# Altium schematic sheet 19_2_Coupled_PP0_Top.SchDoc
size 863 x 558 mm; DocumentNumber: 1; SheetNumber: 1; SheetTotal: 2; PageSetup: Record=PageOptions|CenterHorizontal=True|CenterVertical=True|PrintScale=0.48|XCorrection=1.00|YCorrection=1.00|PrintKind=0|BorderSize=5000000|LeftOffset=0|BottomOffset=0|Orientation=2|PaperLength=1000|PaperWidth=1000|Scale=100|PaperSource=15|PrintQuality=-3|MediaType=1|DitherType=10|PrintScaleMode=1|PaperKind=11x17|PaperIndex=17
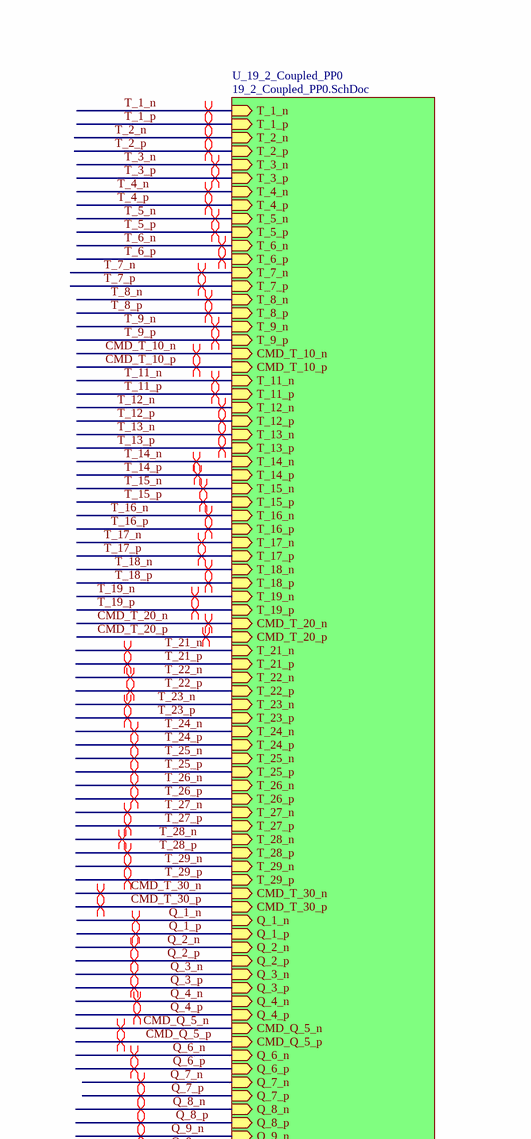
[diagram p0: 19_2_Coupled_PP0_Top.SchDoc, top left]
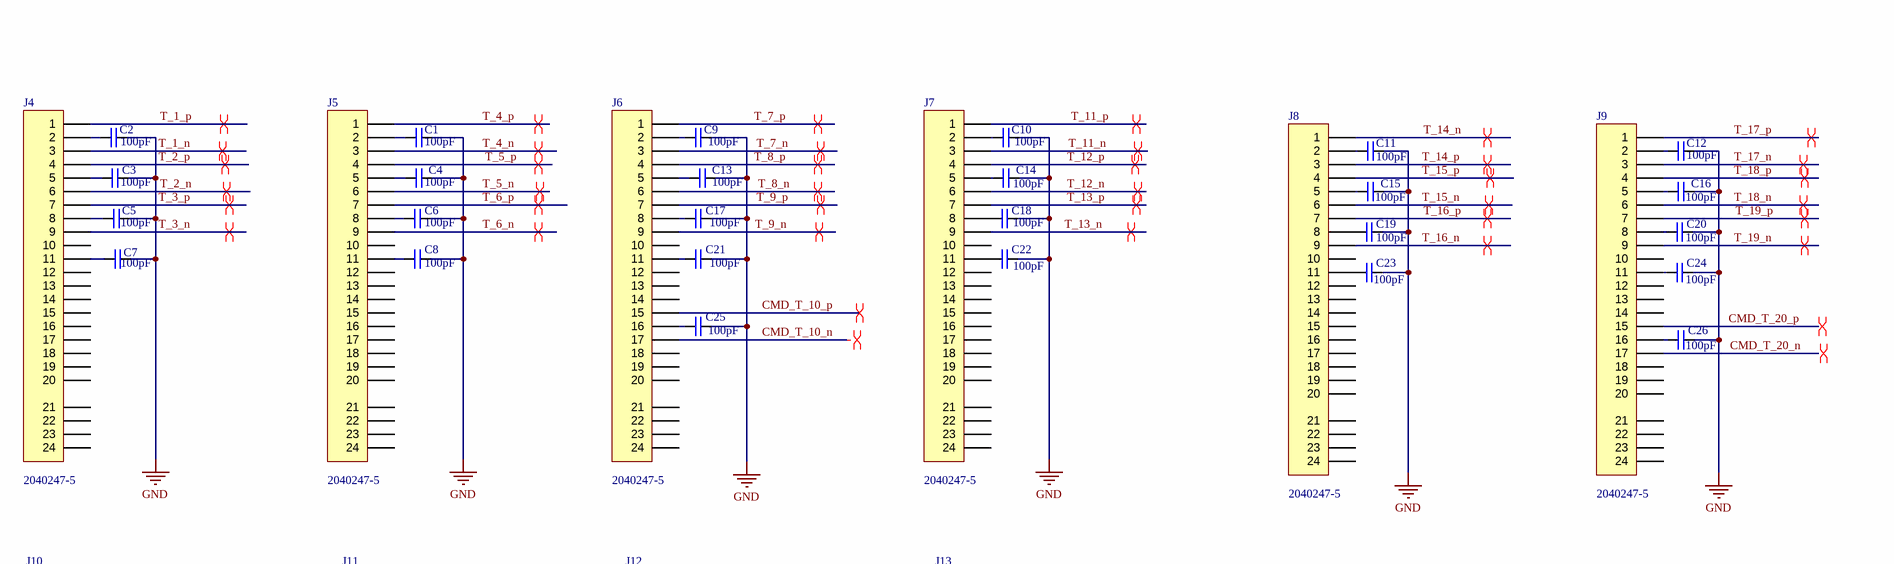
[diagram p1: 19_2_Coupled_PP0_Top.SchDoc, top right]
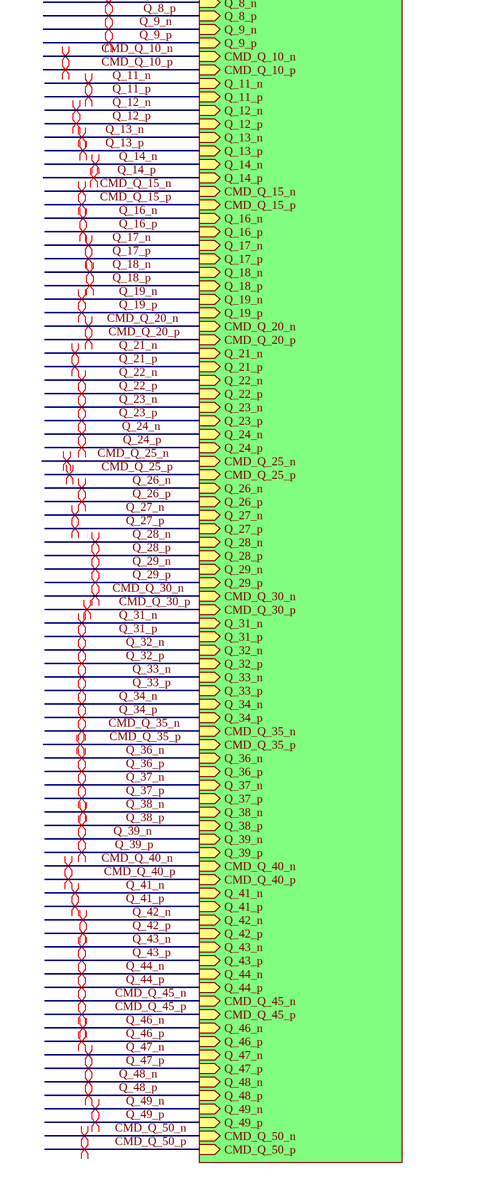
[diagram p2: 19_2_Coupled_PP0_Top.SchDoc, bottom left]
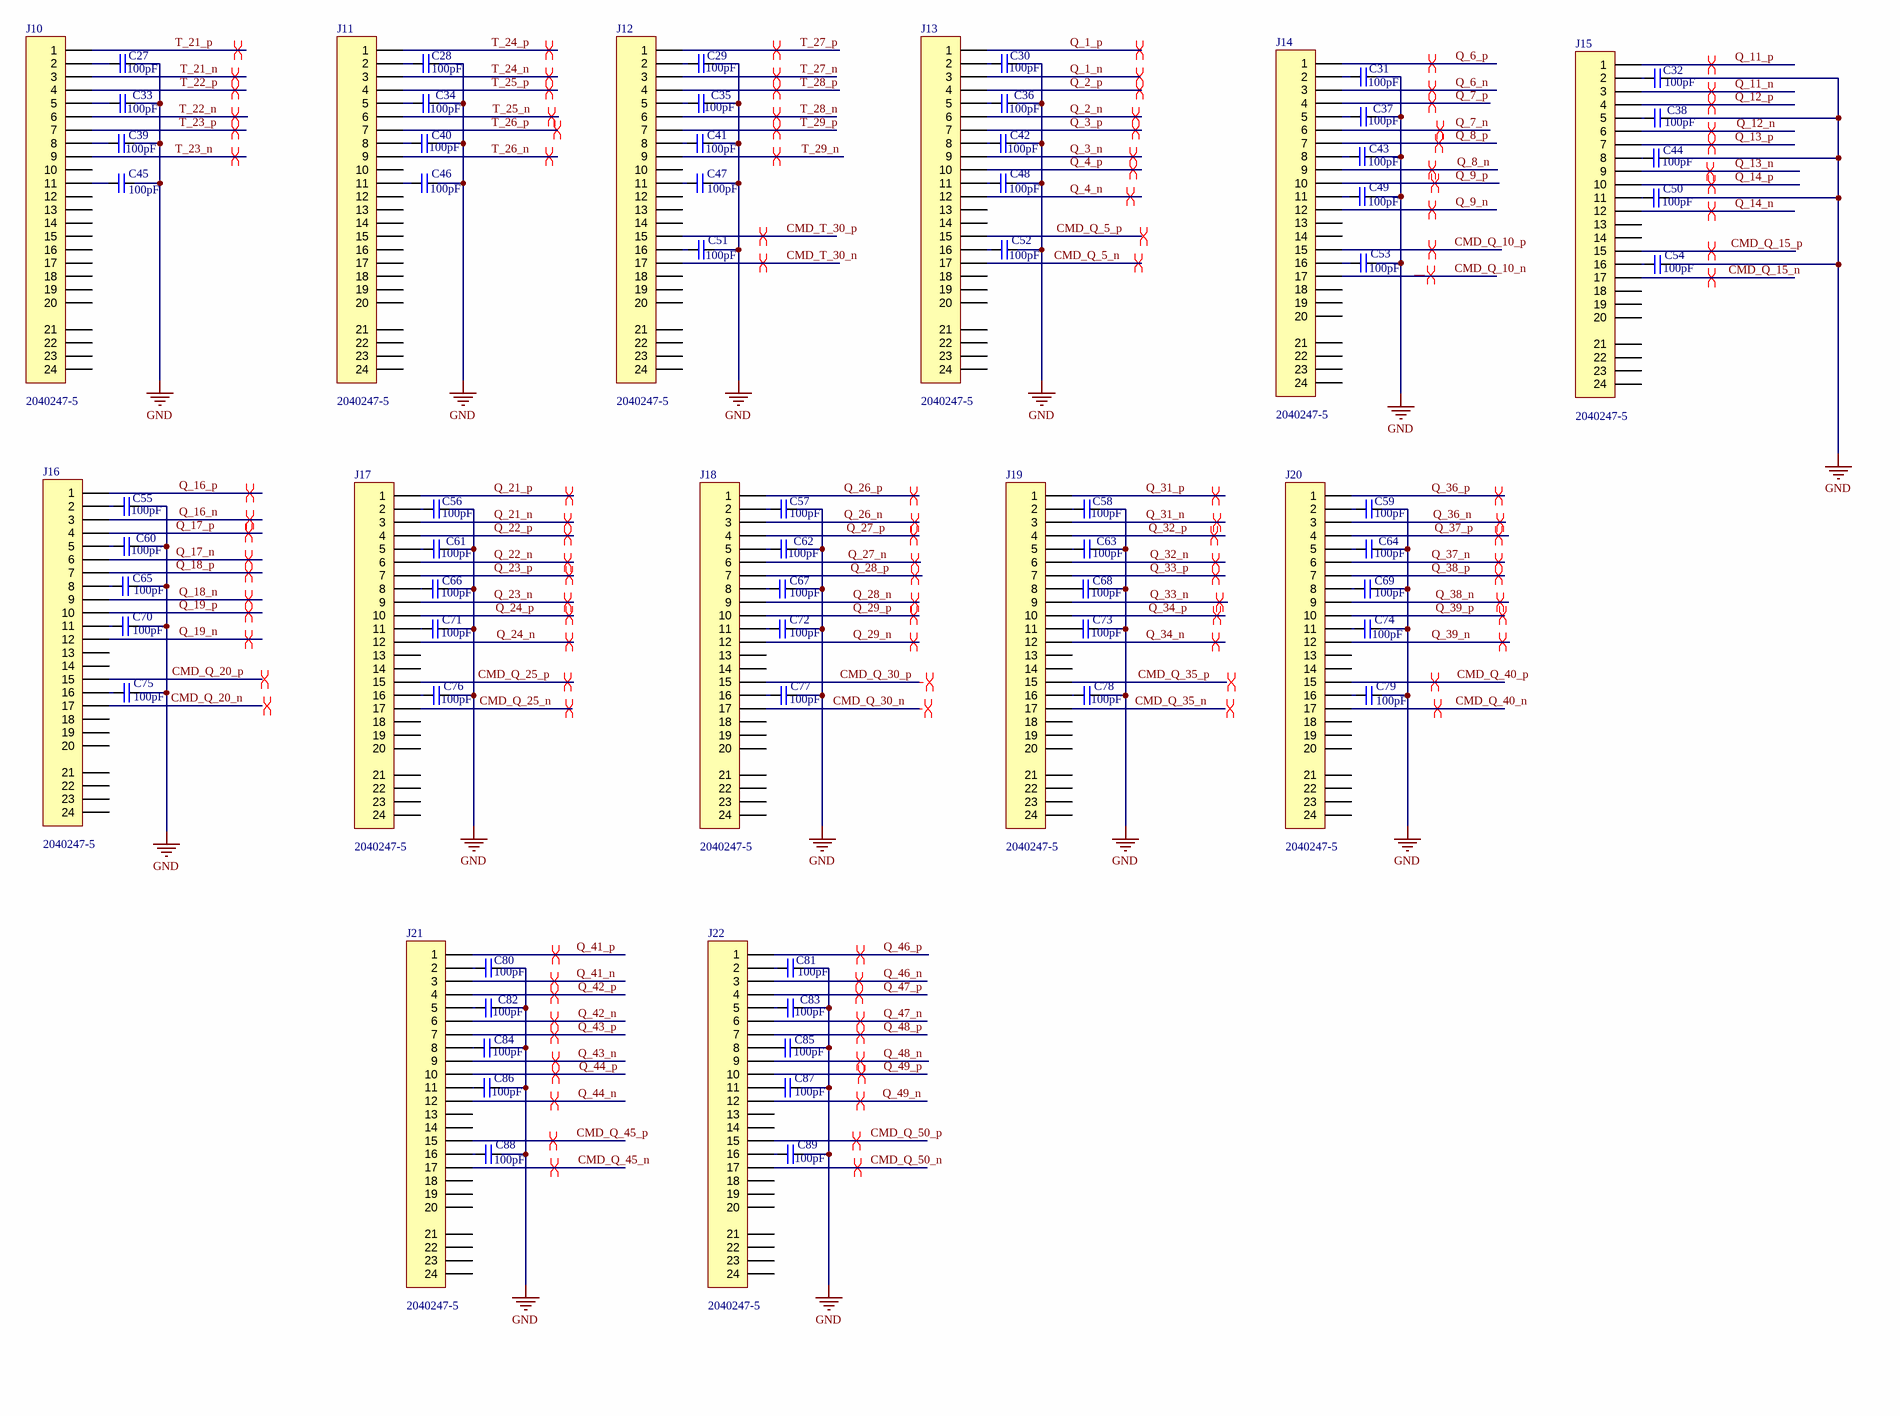
[diagram p3: 19_2_Coupled_PP0_Top.SchDoc, bottom right]

## Parts
C1  100pF  [SM0201]
C2  100pF  [SM0201]
C3  100pF  [SM0201]
C4  100pF  [SM0201]
C5  100pF  [SM0201]
C6  100pF  [SM0201]
C7  100pF  [SM0201]
C8  100pF  [SM0201]
C9  100pF  [SM0201]
C10  100pF  [SM0201]
C11  100pF  [SM0201]
C12  100pF  [SM0201]
C13  100pF  [SM0201]
C14  100pF  [SM0201]
C15  100pF  [SM0201]
C16  100pF  [SM0201]
C17  100pF  [SM0201]
C18  100pF  [SM0201]
C19  100pF  [SM0201]
C20  100pF  [SM0201]
C21  100pF  [SM0201]
C22  100pF  [SM0201]
C23  100pF  [SM0201]
C24  100pF  [SM0201]
C25  100pF  [SM0201]
C26  100pF  [SM0201]
C27  100pF  [SM0201]
C28  100pF  [SM0201]
C29  100pF  [SM0201]
C30  100pF  [SM0201]
C31  100pF  [SM0201]
C32  100pF  [SM0201]
C33  100pF  [SM0201]
C34  100pF  [SM0201]
C35  100pF  [SM0201]
C36  100pF  [SM0201]
C37  100pF  [SM0201]
C38  100pF  [SM0201]
C39  100pF  [SM0201]
C40  100pF  [SM0201]
C41  100pF  [SM0201]
C42  100pF  [SM0201]
C43  100pF  [SM0201]
C44  100pF  [SM0201]
C45  100pF  [SM0201]
C46  100pF  [SM0201]
C47  100pF  [SM0201]
C48  100pF  [SM0201]
C49  100pF  [SM0201]
C50  100pF  [SM0201]
C51  100pF  [SM0201]
C52  100pF  [SM0201]
C53  100pF  [SM0201]
C54  100pF  [SM0201]
C55  100pF  [SM0201]
C56  100pF  [SM0201]
C57  100pF  [SM0201]
C58  100pF  [SM0201]
C59  100pF  [SM0201]
C60  100pF  [SM0201]
C61  100pF  [SM0201]
C62  100pF  [SM0201]
C63  100pF  [SM0201]
C64  100pF  [SM0201]
C65  100pF  [SM0201]
C66  100pF  [SM0201]
C67  100pF  [SM0201]
C68  100pF  [SM0201]
C69  100pF  [SM0201]
C70  100pF  [SM0201]
C71  100pF  [SM0201]
C72  100pF  [SM0201]
C73  100pF  [SM0201]
C74  100pF  [SM0201]
C75  100pF  [SM0201]
C76  100pF  [SM0201]
C77  100pF  [SM0201]
C78  100pF  [SM0201]
C79  100pF  [SM0201]
C80  100pF  [SM0201]
C81  100pF  [SM0201]
C82  100pF  [SM0201]
C83  100pF  [SM0201]
C84  100pF  [SM0201]
C85  100pF  [SM0201]
C86  100pF  [SM0201]
C87  100pF  [SM0201]
C88  100pF  [SM0201]
C89  100pF  [SM0201]
J4  2040247-5  [Tyco_2040247-5]
J5  2040247-5  [Tyco_2040247-5]
J6  2040247-5  [Tyco_2040247-5]
J7  2040247-5  [Tyco_2040247-5]
J8  2040247-5  [Tyco_2040247-5]
J9  2040247-5  [Tyco_2040247-5]
J10  2040247-5  [Tyco_2040247-5]
J11  2040247-5  [Tyco_2040247-5]
J12  2040247-5  [Tyco_2040247-5]
J13  2040247-5  [Tyco_2040247-5]
J14  2040247-5  [Tyco_2040247-5]
J15  2040247-5  [Tyco_2040247-5]
J16  2040247-5  [Tyco_2040247-5]
J17  2040247-5  [Tyco_2040247-5]
J18  2040247-5  [Tyco_2040247-5]
J19  2040247-5  [Tyco_2040247-5]
J20  2040247-5  [Tyco_2040247-5]
J21  2040247-5  [Tyco_2040247-5]
J22  2040247-5  [Tyco_2040247-5]

## Sub-sheets
U_19_2_Coupled_PP0 = 19_2_Coupled_PP0.SchDoc: T_1_n (in), T_1_p (in), T_2_n (in), T_2_p (in), T_3_n (in), T_3_p (in), T_4_n (in), T_4_p (in), T_5_n (in), T_5_p (in), T_6_n (in), T_6_p (in), T_7_n (in), T_7_p (in), T_8_n (in), T_8_p (in), T_9_n (in), T_9_p (in), CMD_T_10_n (in), CMD_T_10_p (in), T_11_n (in), T_11_p (in), T_12_n (in), T_12_p (in), T_13_n (in), T_13_p (in), T_14_n (in), T_14_p (in), T_15_n (in), T_15_p (in), T_16_n (in), T_16_p (in), T_17_n (in), T_17_p (in), T_18_n (in), T_18_p (in), T_19_n (in), T_19_p (in), CMD_T_20_n (in), CMD_T_20_p (in), T_21_n (in), T_21_p (in), T_22_n (in), T_22_p (in), T_23_n (in), T_23_p (in), T_24_n (in), T_24_p (in), T_25_n (in), T_25_p (in), T_26_n (in), T_26_p (in), T_27_n (in), T_27_p (in), T_28_n (in), T_28_p (in), T_29_n (in), T_29_p (in), CMD_T_30_n (in), CMD_T_30_p (in), Q_1_n (in), Q_1_p (in), Q_2_n (in), Q_2_p (in), Q_3_n (in), Q_3_p (in), Q_4_n (in), Q_4_p (in), CMD_Q_5_n (in), CMD_Q_5_p (in), Q_6_n (in), Q_6_p (in), Q_7_n (in), Q_7_p (in), Q_8_n (in), Q_8_p (in), Q_9_n (in), Q_9_p (in), CMD_Q_10_n (in), CMD_Q_10_p (in), Q_11_n (in), Q_11_p (in), Q_12_n (in), Q_12_p (in), Q_13_n (in), Q_13_p (in), Q_14_n (in), Q_14_p (in), CMD_Q_15_n (in), CMD_Q_15_p (in), Q_16_n (in), Q_16_p (in), Q_17_n (in), Q_17_p (in), Q_18_n (in), Q_18_p (in), Q_19_n (in), Q_19_p (in), CMD_Q_20_n (in), CMD_Q_20_p (in), Q_21_n (in), Q_21_p (in), Q_22_n (in), Q_22_p (in), Q_23_n (in), Q_23_p (in), Q_24_n (in), Q_24_p (in), CMD_Q_25_n (in), CMD_Q_25_p (in), Q_26_n (in), Q_26_p (in), Q_27_n (in), Q_27_p (in), Q_28_n (in), Q_28_p (in), Q_29_n (in), Q_29_p (in), CMD_Q_30_n (in), CMD_Q_30_p (in), Q_31_n (in), Q_31_p (in), Q_32_n (in), Q_32_p (in), Q_33_n (in), Q_33_p (in), Q_34_n (in), Q_34_p (in), CMD_Q_35_n (in), CMD_Q_35_p (in), Q_36_n (in), Q_36_p (in), Q_37_n (in), Q_37_p (in), Q_38_n (in), Q_38_p (in), Q_39_n (in), Q_39_p (in), CMD_Q_40_n (in), CMD_Q_40_p (in), Q_41_n (in), Q_41_p (in), Q_42_n (in), Q_42_p (in), Q_43_n (in), Q_43_p (in), Q_44_n (in), Q_44_p (in), CMD_Q_45_n (in), CMD_Q_45_p (in), Q_46_n (in), Q_46_p (in), Q_47_n (in), Q_47_p (in), Q_48_n (in), Q_48_p (in), Q_49_n (in), Q_49_p (in), CMD_Q_50_n (in), CMD_Q_50_p (in)

## Nets
GND: C1.1 C2.1 C3.1 C4.1 C5.1 C6.1 C7.1 C8.1 C9.1 C10.1 C11.1 C12.1 C13.1 C14.1 C15.1 C16.1 C17.1 C18.1 C19.1 C20.1 C21.1 C22.1 C23.1 C24.1 C25.1 C26.1 C27.1 C28.1 C29.1 C30.1 C31.1 C32.1 C33.1 C34.1 C35.1 C36.1 C37.1 C38.1 C39.1 C40.1 C41.1 C42.1 C43.1 C44.1 C45.1 C46.1 C47.1 C48.1 C49.1 C50.1 C51.1 C52.1 C53.1 C54.1 C55.1 C56.1 C57.1 C58.1 C59.1 C60.1 C61.1 C62.1 C63.1 C64.1 C65.1 C66.1 C67.1 C68.1 C69.1 C70.1 C71.1 C72.1 C73.1 C74.1 C75.1 C76.1 C77.1 C78.1 C79.1 C80.1 C81.1 C82.1 C83.1 C84.1 C85.1 C86.1 C87.1 C88.1 C89.1
CMD_Q_5_n: J13.17 ; sheet U_19_2_Coupled_PP0/CMD_Q_5_n
CMD_Q_5_p: J13.15 ; sheet U_19_2_Coupled_PP0/CMD_Q_5_p
CMD_Q_10_n: J14.17 ; sheet U_19_2_Coupled_PP0/CMD_Q_10_n
CMD_Q_10_p: J14.15 ; sheet U_19_2_Coupled_PP0/CMD_Q_10_p
CMD_Q_15_n: J15.17 ; sheet U_19_2_Coupled_PP0/CMD_Q_15_n
CMD_Q_15_p: J15.15 ; sheet U_19_2_Coupled_PP0/CMD_Q_15_p
CMD_Q_20_n: J16.17 ; sheet U_19_2_Coupled_PP0/CMD_Q_20_n
CMD_Q_20_p: J16.15 ; sheet U_19_2_Coupled_PP0/CMD_Q_20_p
CMD_Q_25_n: J17.17 ; sheet U_19_2_Coupled_PP0/CMD_Q_25_n
CMD_Q_25_p: J17.15 ; sheet U_19_2_Coupled_PP0/CMD_Q_25_p
CMD_Q_30_n: J18.17 ; sheet U_19_2_Coupled_PP0/CMD_Q_30_n
CMD_Q_30_p: J18.15 ; sheet U_19_2_Coupled_PP0/CMD_Q_30_p
CMD_Q_35_n: J19.17 ; sheet U_19_2_Coupled_PP0/CMD_Q_35_n
CMD_Q_35_p: J19.15 ; sheet U_19_2_Coupled_PP0/CMD_Q_35_p
CMD_Q_40_n: J20.17 ; sheet U_19_2_Coupled_PP0/CMD_Q_40_n
CMD_Q_40_p: J20.15 ; sheet U_19_2_Coupled_PP0/CMD_Q_40_p
CMD_Q_45_n: J21.17 ; sheet U_19_2_Coupled_PP0/CMD_Q_45_n
CMD_Q_45_p: J21.15 ; sheet U_19_2_Coupled_PP0/CMD_Q_45_p
CMD_Q_50_n: J22.17 ; sheet U_19_2_Coupled_PP0/CMD_Q_50_n
CMD_Q_50_p: J22.15 ; sheet U_19_2_Coupled_PP0/CMD_Q_50_p
CMD_T_10_n: J6.17 ; sheet U_19_2_Coupled_PP0/CMD_T_10_n
CMD_T_10_p: J6.15 ; sheet U_19_2_Coupled_PP0/CMD_T_10_p
CMD_T_20_n: J9.17 ; sheet U_19_2_Coupled_PP0/CMD_T_20_n
CMD_T_20_p: J9.15 ; sheet U_19_2_Coupled_PP0/CMD_T_20_p
CMD_T_30_n: J12.17 ; sheet U_19_2_Coupled_PP0/CMD_T_30_n
CMD_T_30_p: J12.15 ; sheet U_19_2_Coupled_PP0/CMD_T_30_p
Q_1_n: J13.3 ; sheet U_19_2_Coupled_PP0/Q_1_n
Q_1_p: J13.1 ; sheet U_19_2_Coupled_PP0/Q_1_p
Q_2_n: J13.6 ; sheet U_19_2_Coupled_PP0/Q_2_n
Q_2_p: J13.4 ; sheet U_19_2_Coupled_PP0/Q_2_p
Q_3_n: J13.9 ; sheet U_19_2_Coupled_PP0/Q_3_n
Q_3_p: J13.7 ; sheet U_19_2_Coupled_PP0/Q_3_p
Q_4_n: J13.12 ; sheet U_19_2_Coupled_PP0/Q_4_n
Q_4_p: J13.10 ; sheet U_19_2_Coupled_PP0/Q_4_p
Q_6_n: J14.3 ; sheet U_19_2_Coupled_PP0/Q_6_n
Q_6_p: J14.1 ; sheet U_19_2_Coupled_PP0/Q_6_p
Q_7_n: J14.6 ; sheet U_19_2_Coupled_PP0/Q_7_n
Q_7_p: J14.4 ; sheet U_19_2_Coupled_PP0/Q_7_p
Q_8_n: J14.9 ; sheet U_19_2_Coupled_PP0/Q_8_n
Q_8_p: J14.7 ; sheet U_19_2_Coupled_PP0/Q_8_p
Q_9_n: J14.12 ; sheet U_19_2_Coupled_PP0/Q_9_n
Q_9_p: J14.10 ; sheet U_19_2_Coupled_PP0/Q_9_p
Q_11_n: J15.3 ; sheet U_19_2_Coupled_PP0/Q_11_n
Q_11_p: J15.1 ; sheet U_19_2_Coupled_PP0/Q_11_p
Q_12_n: J15.6 ; sheet U_19_2_Coupled_PP0/Q_12_n
Q_12_p: J15.4 ; sheet U_19_2_Coupled_PP0/Q_12_p
Q_13_n: J15.9 ; sheet U_19_2_Coupled_PP0/Q_13_n
Q_13_p: J15.7 ; sheet U_19_2_Coupled_PP0/Q_13_p
Q_14_n: J15.12 ; sheet U_19_2_Coupled_PP0/Q_14_n
Q_14_p: J15.10 ; sheet U_19_2_Coupled_PP0/Q_14_p
Q_16_n: J16.3 ; sheet U_19_2_Coupled_PP0/Q_16_n
Q_16_p: J16.1 ; sheet U_19_2_Coupled_PP0/Q_16_p
Q_17_n: J16.6 ; sheet U_19_2_Coupled_PP0/Q_17_n
Q_17_p: J16.4 ; sheet U_19_2_Coupled_PP0/Q_17_p
Q_18_n: J16.9 ; sheet U_19_2_Coupled_PP0/Q_18_n
Q_18_p: J16.7 ; sheet U_19_2_Coupled_PP0/Q_18_p
Q_19_n: J16.12 ; sheet U_19_2_Coupled_PP0/Q_19_n
Q_19_p: J16.10 ; sheet U_19_2_Coupled_PP0/Q_19_p
Q_21_n: J17.3 ; sheet U_19_2_Coupled_PP0/Q_21_n
Q_21_p: J17.1 ; sheet U_19_2_Coupled_PP0/Q_21_p
Q_22_n: J17.6 ; sheet U_19_2_Coupled_PP0/Q_22_n
Q_22_p: J17.4 ; sheet U_19_2_Coupled_PP0/Q_22_p
Q_23_n: J17.9 ; sheet U_19_2_Coupled_PP0/Q_23_n
Q_23_p: J17.7 ; sheet U_19_2_Coupled_PP0/Q_23_p
Q_24_n: J17.12 ; sheet U_19_2_Coupled_PP0/Q_24_n
Q_24_p: J17.10 ; sheet U_19_2_Coupled_PP0/Q_24_p
Q_26_n: J18.3 ; sheet U_19_2_Coupled_PP0/Q_26_n
Q_26_p: J18.1 ; sheet U_19_2_Coupled_PP0/Q_26_p
Q_27_n: J18.6 ; sheet U_19_2_Coupled_PP0/Q_27_n
Q_27_p: J18.4 ; sheet U_19_2_Coupled_PP0/Q_27_p
Q_28_n: J18.9 ; sheet U_19_2_Coupled_PP0/Q_28_n
Q_28_p: J18.7 ; sheet U_19_2_Coupled_PP0/Q_28_p
Q_29_n: J18.12 ; sheet U_19_2_Coupled_PP0/Q_29_n
Q_29_p: J18.10 ; sheet U_19_2_Coupled_PP0/Q_29_p
Q_31_n: J19.3 ; sheet U_19_2_Coupled_PP0/Q_31_n
Q_31_p: J19.1 ; sheet U_19_2_Coupled_PP0/Q_31_p
Q_32_n: J19.6 ; sheet U_19_2_Coupled_PP0/Q_32_n
Q_32_p: J19.4 ; sheet U_19_2_Coupled_PP0/Q_32_p
Q_33_n: J19.9 ; sheet U_19_2_Coupled_PP0/Q_33_n
Q_33_p: J19.7 ; sheet U_19_2_Coupled_PP0/Q_33_p
Q_34_n: J19.12 ; sheet U_19_2_Coupled_PP0/Q_34_n
Q_34_p: J19.10 ; sheet U_19_2_Coupled_PP0/Q_34_p
Q_36_n: J20.3 ; sheet U_19_2_Coupled_PP0/Q_36_n
Q_36_p: J20.1 ; sheet U_19_2_Coupled_PP0/Q_36_p
Q_37_n: J20.6 ; sheet U_19_2_Coupled_PP0/Q_37_n
Q_37_p: J20.4 ; sheet U_19_2_Coupled_PP0/Q_37_p
Q_38_n: J20.9 ; sheet U_19_2_Coupled_PP0/Q_38_n
Q_38_p: J20.7 ; sheet U_19_2_Coupled_PP0/Q_38_p
Q_39_n: J20.12 ; sheet U_19_2_Coupled_PP0/Q_39_n
Q_39_p: J20.10 ; sheet U_19_2_Coupled_PP0/Q_39_p
Q_41_n: J21.3 ; sheet U_19_2_Coupled_PP0/Q_41_n
Q_41_p: J21.1 ; sheet U_19_2_Coupled_PP0/Q_41_p
Q_42_n: J21.6 ; sheet U_19_2_Coupled_PP0/Q_42_n
Q_42_p: J21.4 ; sheet U_19_2_Coupled_PP0/Q_42_p
Q_43_n: J21.9 ; sheet U_19_2_Coupled_PP0/Q_43_n
Q_43_p: J21.7 ; sheet U_19_2_Coupled_PP0/Q_43_p
Q_44_n: J21.12 ; sheet U_19_2_Coupled_PP0/Q_44_n
Q_44_p: J21.10 ; sheet U_19_2_Coupled_PP0/Q_44_p
Q_46_n: J22.3 ; sheet U_19_2_Coupled_PP0/Q_46_n
Q_46_p: J22.1 ; sheet U_19_2_Coupled_PP0/Q_46_p
Q_47_n: J22.6 ; sheet U_19_2_Coupled_PP0/Q_47_n
Q_47_p: J22.4 ; sheet U_19_2_Coupled_PP0/Q_47_p
Q_48_n: J22.9 ; sheet U_19_2_Coupled_PP0/Q_48_n
Q_48_p: J22.7 ; sheet U_19_2_Coupled_PP0/Q_48_p
Q_49_n: J22.12 ; sheet U_19_2_Coupled_PP0/Q_49_n
Q_49_p: J22.10 ; sheet U_19_2_Coupled_PP0/Q_49_p
T_1_n: J4.3 ; sheet U_19_2_Coupled_PP0/T_1_n
T_1_p: J4.1 ; sheet U_19_2_Coupled_PP0/T_1_p
T_2_n: J4.6 ; sheet U_19_2_Coupled_PP0/T_2_n
T_2_p: J4.4 ; sheet U_19_2_Coupled_PP0/T_2_p
T_3_n: J4.9 ; sheet U_19_2_Coupled_PP0/T_3_n
T_3_p: J4.7 ; sheet U_19_2_Coupled_PP0/T_3_p
T_4_n: J5.3 ; sheet U_19_2_Coupled_PP0/T_4_n
T_4_p: J5.1 ; sheet U_19_2_Coupled_PP0/T_4_p
T_5_n: J5.6 ; sheet U_19_2_Coupled_PP0/T_5_n
T_5_p: J5.4 ; sheet U_19_2_Coupled_PP0/T_5_p
T_6_n: J5.9 ; sheet U_19_2_Coupled_PP0/T_6_n
T_6_p: J5.7 ; sheet U_19_2_Coupled_PP0/T_6_p
T_7_n: J6.3 ; sheet U_19_2_Coupled_PP0/T_7_n
T_7_p: J6.1 ; sheet U_19_2_Coupled_PP0/T_7_p
T_8_n: J6.6 ; sheet U_19_2_Coupled_PP0/T_8_n
T_8_p: J6.4 ; sheet U_19_2_Coupled_PP0/T_8_p
T_9_n: J6.9 ; sheet U_19_2_Coupled_PP0/T_9_n
T_9_p: J6.7 ; sheet U_19_2_Coupled_PP0/T_9_p
T_11_n: J7.3 ; sheet U_19_2_Coupled_PP0/T_11_n
T_11_p: J7.1 ; sheet U_19_2_Coupled_PP0/T_11_p
T_12_n: J7.6 ; sheet U_19_2_Coupled_PP0/T_12_n
T_12_p: J7.4 ; sheet U_19_2_Coupled_PP0/T_12_p
T_13_n: J7.9 ; sheet U_19_2_Coupled_PP0/T_13_n
T_13_p: J7.7 ; sheet U_19_2_Coupled_PP0/T_13_p
T_14_n: J8.1 ; sheet U_19_2_Coupled_PP0/T_14_n
T_14_p: J8.3 ; sheet U_19_2_Coupled_PP0/T_14_p
T_15_n: J8.6 ; sheet U_19_2_Coupled_PP0/T_15_n
T_15_p: J8.4 ; sheet U_19_2_Coupled_PP0/T_15_p
T_16_n: J8.9 ; sheet U_19_2_Coupled_PP0/T_16_n
T_16_p: J8.7 ; sheet U_19_2_Coupled_PP0/T_16_p
T_17_n: J9.3 ; sheet U_19_2_Coupled_PP0/T_17_n
T_17_p: J9.1 ; sheet U_19_2_Coupled_PP0/T_17_p
T_18_n: J9.6 ; sheet U_19_2_Coupled_PP0/T_18_n
T_18_p: J9.4 ; sheet U_19_2_Coupled_PP0/T_18_p
T_19_n: J9.9 ; sheet U_19_2_Coupled_PP0/T_19_n
T_19_p: J9.7 ; sheet U_19_2_Coupled_PP0/T_19_p
T_21_n: J10.3 ; sheet U_19_2_Coupled_PP0/T_21_n
T_21_p: J10.1 ; sheet U_19_2_Coupled_PP0/T_21_p
T_22_n: J10.6 ; sheet U_19_2_Coupled_PP0/T_22_n
T_22_p: J10.4 ; sheet U_19_2_Coupled_PP0/T_22_p
T_23_n: J10.9 ; sheet U_19_2_Coupled_PP0/T_23_n
T_23_p: J10.7 ; sheet U_19_2_Coupled_PP0/T_23_p
T_24_n: J11.3 ; sheet U_19_2_Coupled_PP0/T_24_n
T_24_p: J11.1 ; sheet U_19_2_Coupled_PP0/T_24_p
T_25_n: J11.6 ; sheet U_19_2_Coupled_PP0/T_25_n
T_25_p: J11.4 ; sheet U_19_2_Coupled_PP0/T_25_p
T_26_n: J11.9 ; sheet U_19_2_Coupled_PP0/T_26_n
T_26_p: J11.7 ; sheet U_19_2_Coupled_PP0/T_26_p
T_27_n: J12.3 ; sheet U_19_2_Coupled_PP0/T_27_n
T_27_p: J12.1 ; sheet U_19_2_Coupled_PP0/T_27_p
T_28_n: J12.6 ; sheet U_19_2_Coupled_PP0/T_28_n
T_28_p: J12.4 ; sheet U_19_2_Coupled_PP0/T_28_p
T_29_n: J12.9 ; sheet U_19_2_Coupled_PP0/T_29_n
T_29_p: J12.7 ; sheet U_19_2_Coupled_PP0/T_29_p
NetC1_2: C1.2 J5.2
NetC2_2: C2.2 J4.2
NetC3_2: C3.2 J4.5
NetC4_2: C4.2 J5.5
NetC5_2: C5.2 J4.8
NetC6_2: C6.2 J5.8
NetC7_2: C7.2 J4.11
NetC8_2: C8.2 J5.11
NetC9_2: C9.2 J6.2
NetC10_2: C10.2 J7.2
NetC11_2: C11.2 J8.2
NetC12_2: C12.2 J9.2
NetC13_2: C13.2 J6.5
NetC14_2: C14.2 J7.5
NetC15_2: C15.2 J8.5
NetC16_2: C16.2 J9.5
NetC17_2: C17.2 J6.8
NetC18_2: C18.2 J7.8
NetC19_2: C19.2 J8.8
NetC20_2: C20.2 J9.8
NetC21_2: C21.2 J6.11
NetC22_2: C22.2 J7.11
NetC23_2: C23.2 J8.11
NetC24_2: C24.2 J9.11
NetC25_2: C25.2 J6.16
NetC26_2: C26.2 J9.16
NetC27_2: C27.2 J10.2
NetC28_2: C28.2 J11.2
NetC29_2: C29.2 J12.2
NetC30_2: C30.2 J13.2
NetC31_2: C31.2 J14.2
NetC32_2: C32.2 J15.2
NetC33_2: C33.2 J10.5
NetC34_2: C34.2 J11.5
NetC35_2: C35.2 J12.5
NetC36_2: C36.2 J13.5
NetC37_2: C37.2 J14.5
NetC38_2: C38.2 J15.5
NetC39_2: C39.2 J10.8
NetC40_2: C40.2 J11.8
NetC41_2: C41.2 J12.8
NetC42_2: C42.2 J13.8
NetC43_2: C43.2 J14.8
NetC44_2: C44.2 J15.8
NetC45_2: C45.2 J10.11
NetC46_2: C46.2 J11.11
NetC47_2: C47.2 J12.11
NetC48_2: C48.2 J13.11
NetC49_2: C49.2 J14.11
NetC50_2: C50.2 J15.11
NetC51_2: C51.2 J12.16
NetC52_2: C52.2 J13.16
NetC53_2: C53.2 J14.16
NetC54_2: C54.2 J15.16
NetC55_2: C55.2 J16.2
NetC56_2: C56.2 J17.2
NetC57_2: C57.2 J18.2
NetC58_2: C58.2 J19.2
NetC59_2: C59.2 J20.2
NetC60_2: C60.2 J16.5
NetC61_2: C61.2 J17.5
NetC62_2: C62.2 J18.5
NetC63_2: C63.2 J19.5
NetC64_2: C64.2 J20.5
NetC65_2: C65.2 J16.8
NetC66_2: C66.2 J17.8
NetC67_2: C67.2 J18.8
NetC68_2: C68.2 J19.8
NetC69_2: C69.2 J20.8
NetC70_2: C70.2 J16.11
NetC71_2: C71.2 J17.11
NetC72_2: C72.2 J18.11
NetC73_2: C73.2 J19.11
NetC74_2: C74.2 J20.11
NetC75_2: C75.2 J16.16
NetC76_2: C76.2 J17.16
NetC77_2: C77.2 J18.16
NetC78_2: C78.2 J19.16
NetC79_2: C79.2 J20.16
NetC80_2: C80.2 J21.2
NetC81_2: C81.2 J22.2
NetC82_2: C82.2 J21.5
NetC83_2: C83.2 J22.5
NetC84_2: C84.2 J21.8
NetC85_2: C85.2 J22.8
NetC86_2: C86.2 J21.11
NetC87_2: C87.2 J22.11
NetC88_2: C88.2 J21.16
NetC89_2: C89.2 J22.16

Not connected (* = marked no-connect by the designer): J4 10 12 13 14 15 16 17 18 19 20 21 22 23 24; J5 10 12 13 14 15 16 17 18 19 20 21 22 23 24; J6 10 12 13 14 18 19 20 21 22 23 24; J7 10 12 13 14 15 16 17 18 19 20 21 22 23 24; J8 10 12 13 14 15 16 17 18 19 20 21 22 23 24; J9 10 12 13 14 18 19 20 21 22 23 24; J10 10 12 13 14 15 16 17 18 19 20 21 22 23 24; J11 10 12 13 14 15 16 17 18 19 20 21 22 23 24; J12 10 12 13 14 18 19 20 21 22 23 24; J13 13 14 18 19 20 21 22 23 24; J14 13 14 18 19 20 21 22 23 24; J15 13 14 18 19 20 21 22 23 24; J16 13 14 18 19 20 21 22 23 24; J17 13 14 18 19 20 21 22 23 24; J18 13 14 18 19 20 21 22 23 24; J19 13 14 18 19 20 21 22 23 24; J20 13 14 18 19 20 21 22 23 24; J21 13 14 18 19 20 21 22 23 24; J22 13 14 18 19 20 21 22 23 24

## Layout directives
differential pair: (no net found under the mark), CMD_Q_5_n, CMD_Q_5_p, CMD_Q_10_n, CMD_Q_10_p, CMD_Q_15_n, CMD_Q_15_p, CMD_Q_20_n, CMD_Q_20_p, CMD_Q_25_n, CMD_Q_25_p, CMD_Q_30_n, CMD_Q_30_p, CMD_Q_35_n, CMD_Q_35_p, CMD_Q_40_n, CMD_Q_40_p, CMD_Q_45_n, CMD_Q_45_p, CMD_Q_50_n, CMD_Q_50_p, CMD_T_10_n, CMD_T_10_p, CMD_T_20_n, CMD_T_20_p, CMD_T_30_n, CMD_T_30_p, Q_1_n, Q_1_p, Q_2_n, Q_2_p, Q_3_n, Q_3_p, Q_4_n, Q_4_p, Q_6_n, Q_6_p, Q_7_n, Q_7_p, Q_8_n, Q_8_p, Q_9_n, Q_9_p, Q_11_n, Q_11_p, Q_12_n, Q_12_p, Q_13_n, Q_13_p, Q_14_n, Q_14_p, Q_16_n, Q_16_p, Q_17_n, Q_17_p, Q_18_n, Q_18_p, Q_19_n, Q_19_p, Q_21_n, Q_21_p, Q_22_n, Q_22_p, Q_23_n, Q_23_p, Q_24_n, Q_24_p, Q_26_n, Q_26_p, Q_27_n, Q_27_p, Q_28_n, Q_28_p, Q_29_n, Q_29_p, Q_31_n, Q_31_p, Q_32_n, Q_32_p, Q_33_n, Q_33_p, Q_34_n, Q_34_p, Q_36_n, Q_36_p, Q_37_n, Q_37_p, Q_38_n, Q_38_p, Q_39_n, Q_39_p, Q_41_n, Q_41_p, Q_42_n, Q_42_p, Q_43_n, Q_43_p, Q_44_n, Q_44_p, Q_46_n, Q_46_p, Q_47_n, Q_47_p, Q_48_n, Q_48_p, Q_49_n, Q_49_p, T_1_n, T_1_p, T_2_n, T_2_p, T_3_n, T_3_p, T_4_n, T_4_p, T_5_n, T_5_p, T_6_n, T_6_p, T_7_n, T_7_p, T_8_n, T_8_p, T_9_n, T_9_p, T_11_n, T_11_p, T_12_n, T_12_p, T_13_n, T_13_p, T_14_n, T_14_p, T_15_n, T_15_p, T_16_n, T_16_p, T_17_n, T_17_p, T_18_n, T_18_p, T_19_n, T_19_p, T_21_n, T_21_p, T_22_n, T_22_p, T_23_n, T_23_p, T_24_n, T_24_p, T_25_n, T_25_p, T_26_n, T_26_p, T_27_n, T_27_p, T_28_n, T_28_p, T_29_n, T_29_p

## Notes on the sheet
- ENGR
- REV
- DESCRIPTION
- DRFT
- CHKR
- APPV
- DATE
- CAD FILE:
- SHEET     OF
- NOT BE COPIED, PUBLISHED OR OTHERWISE FURTHER DISSEMINATED WITHOUT
- THE DRAWINGS, SPECIFICATIONS AND OTHER DATA HEREIN PROVIDED SHALL
- PRIOR WRITTEN PERMISSION OF STANFORD UNIVERSITY / SLAC.
- ENGR:
- APPROVALS
- REVISION
- PRIOR WRITTEN PERMISSION OF STANFORD UNIVERSITY/SLAC
- DRFT:
- CHKR:
- D
- SLAC Release

## Library data of the parts
C1-C89 = C0201N101JW500: PPI, 0201N101JW500; CAP. 100pF 50V 5%, SM0201; Voltage: 500V; Unit_Price_Static: 2.00; Value: 100pF; Manufacturer: PPI; PartNumber: 0201N101JW500; Tolerance: 5%; ComponentLink1Description: Datasheet; ComponentLink1URL: V:\CD\Altium\Datasheets\Capacitors\Kemet\Ceramic Chip Capacitor.pdf; Manufacturer Part Number: 0201N101JW500; Package / Case: SM0201
J4-J22 = Tyco_2040247-5: Tyco; 2040247-5, Display Port Right Angle SMT, Tyco_2040247-5; Unit_Price_Static: 1.00; Manufacturer: TYCO; Package / Case: Tyco_2040247-5; Manufacturer Part Number: 2040247-5; ComponentLink: http://cnctech.us/pdfs/3220-XX-0300-00.pdf